# Altium schematic sheet MODULO CONTROL.SchDoc
size A4
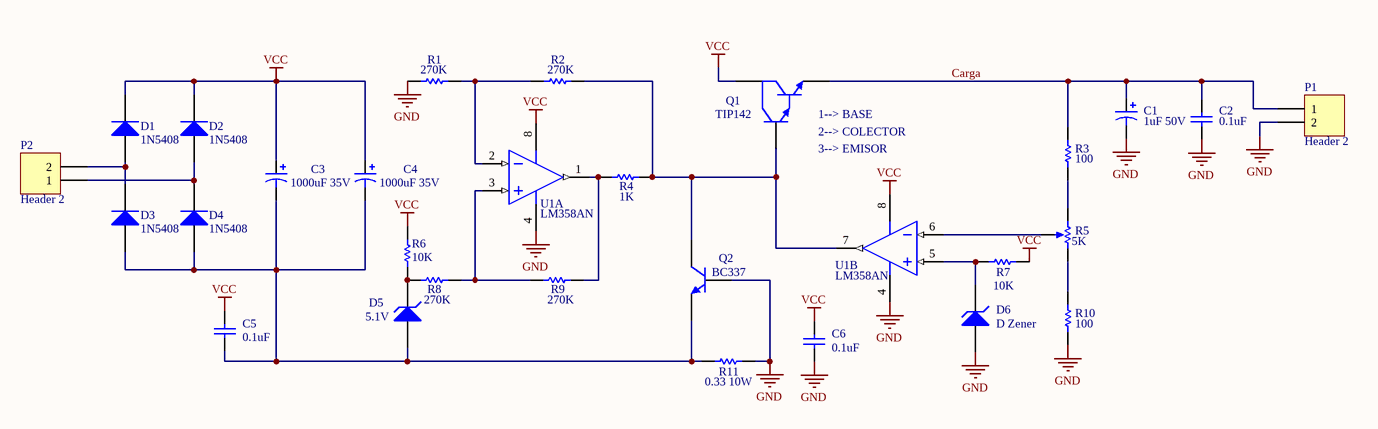
[diagram p0: MODULO CONTROL.SchDoc]

## Parts
C1  value 1uF 50V  [CAPPR2-5x6.8]  (hidden comment: Cap Pol1)
C2  value 0.1uF  [RAD-0.2]  (hidden comment: Cap)
C3  value 1000uF 35V  [RB5-10.5]  (hidden comment: Cap Pol1)
C4  value 1000uF 35V  [RB5-10.5]  (hidden comment: Cap Pol1)
C5  value 0.1uF  [RAD-0.2]  (hidden comment: Cap)
C6  value 0.1uF  [RAD-0.2]  (hidden comment: Cap)
D1  1N5408  [DIO18.84-9.6x5.6]
D2  1N5408  [DIO18.84-9.6x5.6]
D3  1N5408  [DIO18.84-9.6x5.6]
D4  1N5408  [DIO18.84-9.6x5.6]
D5  5.1V  [DIODE-0.4]
D6  D Zener  [DIODE-0.4]
P1  Header 2  [RAD-0.2]
P2  Header 2  [RAD-0.2]
Q1  TIP142  [340K-01]
Q2  BC337  [BCY-W3]
R1  value 270K  [AXIAL-0.4]  (hidden comment: Res1)
R2  value 270K  [AXIAL-0.4]  (hidden comment: Res1)
R3  value 100  [AXIAL-0.4]  (hidden comment: Res1)
R4  value 1K  [AXIAL-0.4]  (hidden comment: Res1)
R5  value 5K  [VR5]  (hidden comment: RPot)
R6  value 10K  [AXIAL-0.4]  (hidden comment: Res1)
R7  value 10K  [AXIAL-0.4]  (hidden comment: Res1)
R8  value 270K  [AXIAL-0.4]  (hidden comment: Res1)
R9  value 270K  [AXIAL-0.4]  (hidden comment: Res1)
R10  value 100  [AXIAL-0.4]  (hidden comment: Res1)
R11  value 0.33 10W  [AXIAL-1.0]  (hidden comment: Res1)
U1  LM358AN  [N08E]  (parts A,B of 2)

## Nets
GND: C1.2 C2.1 C6.1 D6.1(A) P1.2 Q2.2(B) R1.1 R10.1 R11.2 U1.4(GND)
VCC: C3.1 C4.1 C5.2 C6.2 D1.2(K) D2.2(K) Q1.1(C) R6.2 R7.2 U1.8(V+)
Carga: C1.1 C2.2 P1.1 Q1.3(E) R3.2
NetC3_2: C3.2 C4.2 C5.1 D3.1(A) D4.1(A) D5.1(A) Q2.3(E) R11.1
NetD1_1: D1.1(A) D3.2(K) P2.2
NetD2_1: D2.1(A) D4.2(K) P2.1
NetD5_2: D5.2(K) R6.1 R8.1
NetD6_2: D6.2(K) R7.1 U1.5(INB+)
NetQ1_2: Q1.2(B) Q2.1(C) R2.2 R4.2 U1.7(OUTB)
NetR1_2: R1.2 R2.1 U1.2(INA-)
NetR3_1: R3.1 R5.1(TOP)
NetR4_1: R4.1 R9.2 U1.1(OUTA)
NetR5_2: R5.2(BOT) R10.2
NetR5_3: R5.3(TAP) U1.6(INB-)
NetR8_2: R8.2 R9.1 U1.3(INA+)

## Notes on the sheet
- (near Q1) 1--> BASE
- (near Q1) 2--> COLECTOR
- (near Q1) 3--> EMISOR

## Library data of the parts
C1 C3 C4 = Cap Pol1: Polarized Capacitor (Radial); Published: 8-Jun-2000; LatestRevisionDate: 17-Jul-2002; LatestRevisionNote: Re-released for DXP Platform.; PackageReference: RB7.6-15; Publisher: Altium Limited
C2 C5 C6 = Cap: Capacitor; Published: 8-Jun-2000; LatestRevisionDate: 17-Jul-2002; LatestRevisionNote: Re-released for DXP Platform.; PackageReference: RAD-0.3; Publisher: Altium Limited
D1-D4 = Diode 1N5408: 3 Amp Medium Power Silicon Rectifier Diode; Published: 8-Jun-2000; LatestRevisionDate: 17-Jul-2002; LatestRevisionNote: Re-released for DXP Platform.; DatasheetVersion: Aug-1984; PackageReference: DO-201AD; Publisher: Altium Limited; ComponentLink1Description: Manufacturer Link; ComponentLink1URL: http://www.irf.com/
D5 D6 = D Zener: Zener Diode; Published: 8-Jun-2000; LatestRevisionDate: 17-Jul-2002; LatestRevisionNote: Re-released for DXP Platform.; PackageReference: DIODE-0.7; Publisher: Altium Limited
P1 P2 = Header 2: Header, 2-Pin; LatestRevisionDate: 17-Jul-2002; LatestRevisionNote: Re-released for DXP Platform.; Publisher: Altium Limited
Q1 = NPN1: NPN Darlington Bipolar Transistor; Published: 8-Jun-2000; LatestRevisionDate: 17-Jul-2002; LatestRevisionNote: Re-released for DXP Platform.; DatasheetVersion: 1989; PackageVersion: 1989; PackageReference: TO-92; Publisher: Altium Limited; Code_JEDEC: TO-92
Q2 = NPN: NPN Bipolar Transistor; Published: 8-Jun-2000; LatestRevisionDate: 17-Jul-2002; LatestRevisionNote: Re-released for DXP Platform.; PackageReference: TO-226; Publisher: Altium Limited; Code_JEDEC: TO-226-AA
R1-R4 R6-R11 = Res1: Resistor; Published: 8-Jun-2000; LatestRevisionDate: 17-Jul-2002; LatestRevisionNote: Re-released for DXP Platform.; PackageReference: AXIAL-0.3; Publisher: Altium Limited
R5 = RPot: Potentiometer; Sim Note: Enter the Resistance value and the set point into parameter fields.; Set Position: 0.5; Published: 8-Jun-2000; LatestRevisionDate: 17-Jul-2002; LatestRevisionNote: Re-released for DXP Platform.; PackageReference: VR5; Publisher: Altium Limited
U1 = LM358AN: Low Power Dual Operational Amplifier; Manufacturer: National Semiconductor; CompType: Amplifiers; PackageTopMarking: NSUZXYTT*LM*358AN; PowerWise: N; Published: 4-Dec-2008; LatestRevisionDate: 13-Jan-2009; LatestRevisionNote: Sim Model Added.; DatasheetVersion: Oct-2005; PackageVersion: revG, May-2006; PackageReference: N08E; Publisher: Altium Limited; PackageDescription: MDIP, .365 x .250 x .130in, 8 Lead, .100in Pitch; PartNumber: LM358AN; RoHS: O; PinCount: 8; DigiKeyPartNumber: LM358ANNS-ND; Code_JEDEC: MS-001-BA; ComponentLink1Description: LM358 Datasheet; ComponentLink1URL: http://www.national.com/ds/LM/LM358.pdf; ComponentLink2Description: LM358 Web Page; ComponentLink2URL: http://www.national.com/pf/LM/LM358.html; ComponentLink3Description: N08E Package Page; ComponentLink3URL: http://www.national.com/packaging/folders/n08e.html